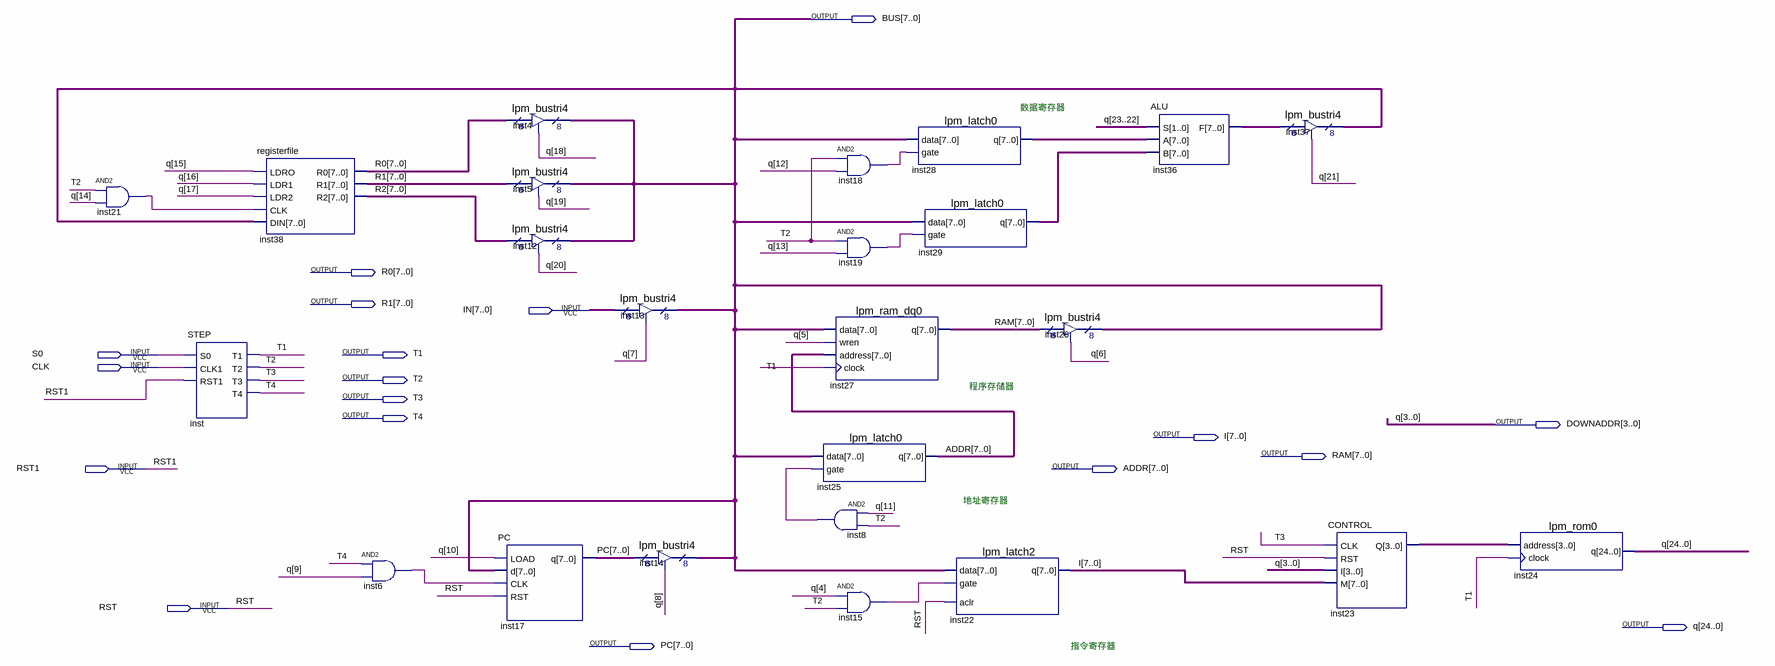
[diagram p0: schematic sheet]
// Quartus schematic 150341309.bdf as structural Verilog: 24 symbols, 18 pins
module \150341309  (
  input  [7:0] IN,
  input  S0,
  input  CLK,
  input  RST1,
  input  RST,
  output [7:0] BUS,
  output [7:0] R0,
  output [7:0] R1,
  output T1,
  output T2,
  output T3,
  output T4,
  output [3:0] DOWNADDR,
  output [7:0] I,
  output [7:0] RAM,
  output [7:0] ADDR,
  output [24:0] q,
  output [7:0] PC
);

  wire inst6_out, inst8_out, inst15_out, inst18_out, inst19_out, inst21_out;
  wire [3:0] inst23_q;
  wire [7:0] inst28_q, inst29_q, inst36_f, R2;

  and inst21 (inst21_out, T2, q[14]);
  STEP inst (.S0(S0), .CLK1(CLK), .RST1(RST1), .T1(T1), .T2(T2), .T3(T3), .T4(T4));
  registerfile inst38 (
    .LDRO(q[15]), .LDR1(q[16]), .LDR2(q[17]), .CLK(inst21_out), .DIN(BUS), .R0(R0), .R1(R1), .R2(R2));
  and inst6 (inst6_out, T4, q[9]);
  PC inst17 (.LOAD(q[10]), .d(BUS), .CLK(inst6_out), .RST(RST), .q(PC));
  lpm_bustri4 inst4 (.enabledt(q[18]), .data(R0), .tridata(BUS));
  lpm_bustri4 inst5 (.enabledt(q[19]), .data(R1), .tridata(BUS));
  lpm_bustri4 inst12 (.enabledt(q[20]), .data(R2), .tridata(BUS));
  lpm_bustri4 inst13 (.enabledt(q[7]), .data(IN), .tridata(BUS));
  lpm_bustri4 inst14 (.enabledt(q[8]), .data(PC), .tridata(BUS));
  and inst18 (inst18_out, T2, q[12]);
  and inst19 (inst19_out, T2, q[13]);
  lpm_ram_dq0 inst27 (.data(BUS), .wren(q[5]), .address(ADDR), .clock(T1), .q(RAM));
  lpm_latch0 inst25 (.data(BUS), .gate(inst8_out), .q(ADDR));
  and inst8 (inst8_out, q[11], T2);
  and inst15 (inst15_out, q[4], T2);
  lpm_latch0 inst28 (.data(BUS), .gate(inst18_out), .q(inst28_q));
  lpm_latch0 inst29 (.data(BUS), .gate(inst19_out), .q(inst29_q));
  lpm_latch2 inst22 (.data(BUS), .gate(inst15_out), .aclr(RST), .q(I));
  lpm_bustri4 inst26 (.enabledt(q[6]), .data(RAM), .tridata(BUS));
  ALU inst36 (.S(q[23:22]), .A(inst28_q), .B(inst29_q), .F(inst36_f));
  lpm_bustri4 inst37 (.enabledt(q[21]), .data(inst36_f), .tridata(BUS));
  CONTROL inst23 (.CLK(T3), .RST(RST), .I(DOWNADDR), .M(I), .Q(inst23_q));
  lpm_rom0 inst24 (.address(inst23_q), .clock(T1), .q({q[24:4], DOWNADDR}));

  assign q[3:0] = DOWNADDR;

  // Notes on the sheet:
  //   数据寄存器
  //   程序存储器
  //   地址寄存器
  //   指令寄存器
endmodule
